# EAGLE schematic BLUEPILL_full_schematic (EAGLE 9.6.2)
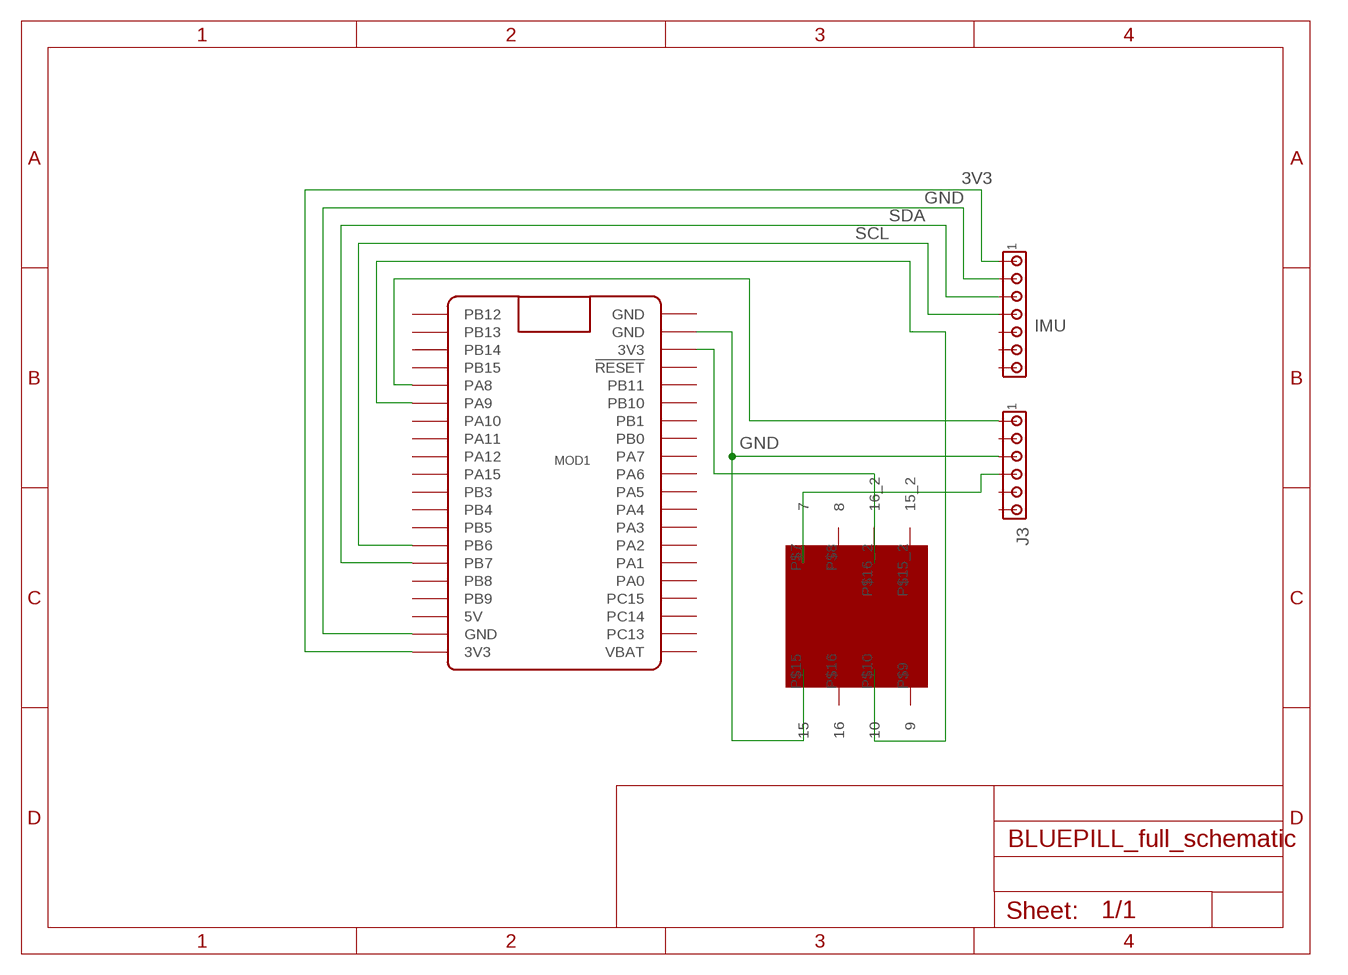
[diagram p0: schematic, sheet 1]

## Parts
IMU  MTA07-100  [10X07MTA]
J3  MTA06-100  [10X06MTA]
MOD1  BLUE_PILL  [BLUE_PILL]
U$1  MAX3232_CUSTOM  [MAX3232_CUSTOM]

## Nets
3V3: IMU.1 MOD1.P$20(3V3)
7: J3.4 U$1.P$7
10: MOD1.P$6(PA9) U$1.P$10
16: MOD1.P$23(3V3) U$1.P$16_2(16_2)
GND: IMU.2 J3.3 MOD1.P$19(GND) MOD1.P$22(GND) U$1.P$15
N$2: J3.1 MOD1.P$5(PA8)
SCL: IMU.4 MOD1.P$14(PB6)
SDA: IMU.3 MOD1.P$15(PB7)
Unconnected: IMU.5 IMU.6 IMU.7 J3.2 J3.5 J3.6 MOD1.P$1(PB12) MOD1.P$2(PB13) MOD1.P$3(PB14) MOD1.P$4(PB15) MOD1.P$7(PA10) MOD1.P$8(PA11) MOD1.P$9(PA12) MOD1.P$10(PA15) MOD1.P$11(PB3) MOD1.P$12(PB4) MOD1.P$13(PB5) MOD1.P$16(PB8) MOD1.P$17(PB9) MOD1.P$18(5V) MOD1.P$21(GND) MOD1.P$24(!RESET) MOD1.P$25(PB11) MOD1.P$26(PB10) MOD1.P$27(PB1) MOD1.P$28(PB0) MOD1.P$29(PA7) MOD1.P$30(PA6) MOD1.P$31(PA5) MOD1.P$32(PA4) MOD1.P$33(PA3) MOD1.P$34(PA2) MOD1.P$35(PA1) MOD1.P$36(PA0) MOD1.P$37(PC15) MOD1.P$38(PC14) MOD1.P$39(PC13) MOD1.P$40(VBAT) U$1.P$8 U$1.P$9 U$1.P$15_2(15_2) U$1.P$16

## Library data of the parts
IMU = con-amp:MTA07-100: AMP connector
J3 = con-amp:MTA06-100: AMP connector Connection corrected 2014-09-19
MOD1 = BluePill:BLUE_PILL
U$1 = max3232_custom_schematic_v1:MAX3232_CUSTOM